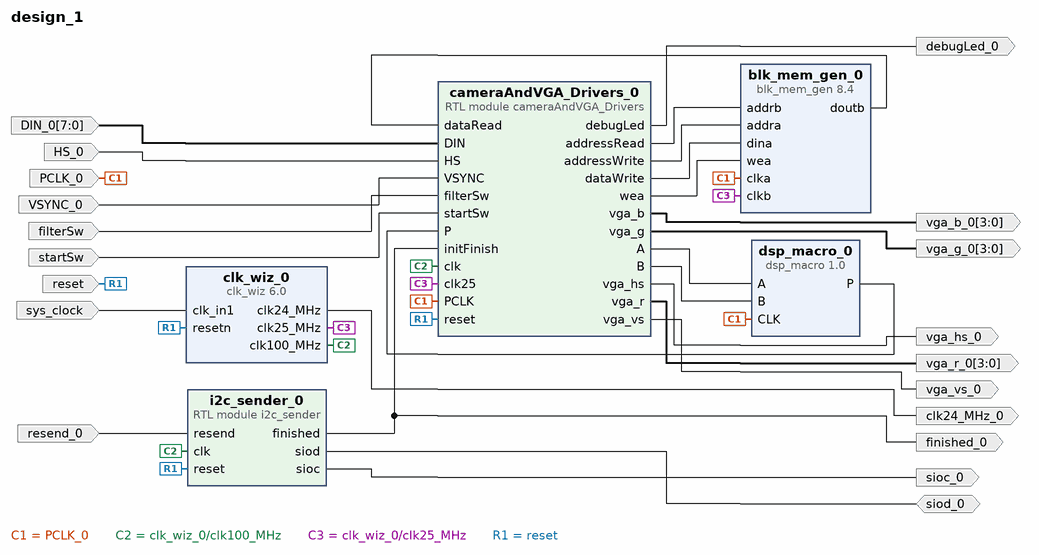
[diagram p0: block diagram of the top level]
# Vivado block design design_1, xc7a100tcsg324-1, Vivado 2021.2
create_bd_design design_1

create_bd_port -dir I -type clk sys_clock
set_property -dict {CONFIG.FREQ_HZ 100000000 CONFIG.PHASE 0.0} [get_bd_ports sys_clock]
create_bd_port -dir I -type rst reset
set_property -dict {CONFIG.POLARITY ACTIVE_LOW} [get_bd_ports reset]
create_bd_port -dir I HS_0
create_bd_port -dir I VSYNC_0
create_bd_port -dir O vga_hs_0
create_bd_port -dir I -from 7 -to 0 DIN_0
create_bd_port -dir I PCLK_0
create_bd_port -dir O vga_vs_0
create_bd_port -dir O -from 3 -to 0 vga_b_0
create_bd_port -dir O -from 3 -to 0 vga_g_0
create_bd_port -dir O -from 3 -to 0 vga_r_0
create_bd_port -dir I resend_0
create_bd_port -dir IO siod_0
create_bd_port -dir O sioc_0
create_bd_port -dir O finished_0
create_bd_port -dir O -type clk clk24_MHz_0
set_property -dict {CONFIG.FREQ_HZ 24000000} [get_bd_ports clk24_MHz_0]
create_bd_port -dir O debugLed_0
create_bd_port -dir I startSw
create_bd_port -dir I filterSw

create_bd_cell -type ip -vlnv xilinx.com:ip:blk_mem_gen:8.4 blk_mem_gen_0
set_property -dict [list \
  CONFIG.Coe_File ../../../../../../../frame1_2.coe \
  CONFIG.Enable_32bit_Address false \
  CONFIG.Enable_A Always_Enabled \
  CONFIG.Enable_B Always_Enabled \
  CONFIG.Fill_Remaining_Memory_Locations true \
  CONFIG.Load_Init_File true \
  CONFIG.Memory_Type Simple_Dual_Port_RAM \
  CONFIG.Operating_Mode_A NO_CHANGE \
  CONFIG.Port_B_Clock 100 \
  CONFIG.Port_B_Enable_Rate 100 \
  CONFIG.Read_Width_B 12 \
  CONFIG.Register_PortB_Output_of_Memory_Primitives false \
  CONFIG.Remaining_Memory_Locations 0 \
  CONFIG.Use_Byte_Write_Enable false \
  CONFIG.Write_Depth_A 307200 \
  CONFIG.Write_Width_A 12 \
  CONFIG.Write_Width_B 12 \
  CONFIG.use_bram_block Stand_Alone \
] [get_bd_cells blk_mem_gen_0]
create_bd_cell -type ip -vlnv xilinx.com:ip:clk_wiz:6.0 clk_wiz_0
set_property -dict [list \
  CONFIG.CLKOUT1_JITTER 151.366 \
  CONFIG.CLKOUT1_PHASE_ERROR 132.063 \
  CONFIG.CLKOUT2_JITTER 200.470 \
  CONFIG.CLKOUT2_PHASE_ERROR 132.063 \
  CONFIG.CLKOUT2_REQUESTED_OUT_FREQ 25 \
  CONFIG.CLKOUT2_USED true \
  CONFIG.CLKOUT3_JITTER 202.114 \
  CONFIG.CLKOUT3_PHASE_ERROR 132.063 \
  CONFIG.CLKOUT3_REQUESTED_OUT_FREQ 24 \
  CONFIG.CLKOUT3_USED true \
  CONFIG.CLK_IN1_BOARD_INTERFACE sys_clock \
  CONFIG.CLK_OUT1_PORT clk100_MHz \
  CONFIG.CLK_OUT2_PORT clk25_MHz \
  CONFIG.CLK_OUT3_PORT clk24_MHz \
  CONFIG.MMCM_CLKFBOUT_MULT_F 6.000 \
  CONFIG.MMCM_CLKIN1_PERIOD 10.0 \
  CONFIG.MMCM_CLKIN2_PERIOD 10.0 \
  CONFIG.MMCM_CLKOUT0_DIVIDE_F 6.000 \
  CONFIG.MMCM_CLKOUT1_DIVIDE 24 \
  CONFIG.MMCM_CLKOUT2_DIVIDE 25 \
  CONFIG.NUM_OUT_CLKS 3 \
  CONFIG.RESET_BOARD_INTERFACE reset \
  CONFIG.RESET_PORT resetn \
  CONFIG.RESET_TYPE ACTIVE_LOW \
  CONFIG.USE_BOARD_FLOW true \
] [get_bd_cells clk_wiz_0]
create_bd_cell -type module -reference i2c_sender i2c_sender_0
create_bd_cell -type ip -vlnv xilinx.com:ip:dsp_macro:1.0 dsp_macro_0
set_property -dict [list \
  CONFIG.areg_3 false \
  CONFIG.areg_4 true \
  CONFIG.breg_3 false \
  CONFIG.breg_4 true \
  CONFIG.creg_3 false \
  CONFIG.creg_4 false \
  CONFIG.creg_5 false \
  CONFIG.instruction1 {A*B} \
  CONFIG.mreg_5 false \
  CONFIG.p_binarywidth 0 \
  CONFIG.p_full_width 36 \
  CONFIG.p_width 36 \
  CONFIG.pipeline_options By_Tier \
  CONFIG.preg_6 true \
  CONFIG.tier_4 true \
  CONFIG.tier_6 true \
] [get_bd_cells dsp_macro_0]
create_bd_cell -type module -reference cameraAndVGA_Drivers cameraAndVGA_Drivers_0

# ---- connections ----

connect_bd_net -net DIN_0_1 [get_bd_ports DIN_0] [get_bd_pins cameraAndVGA_Drivers_0/DIN]
connect_bd_net -net HS_0_1 [get_bd_ports HS_0] [get_bd_pins cameraAndVGA_Drivers_0/HS]
connect_bd_net [get_bd_ports siod_0] [get_bd_pins i2c_sender_0/siod]
connect_bd_net -net PCLK_0_1 [get_bd_ports PCLK_0] \
  [get_bd_pins blk_mem_gen_0/clka] [get_bd_pins dsp_macro_0/CLK] [get_bd_pins cameraAndVGA_Drivers_0/PCLK]
connect_bd_net -net VSYNC_0_1 [get_bd_ports VSYNC_0] [get_bd_pins cameraAndVGA_Drivers_0/VSYNC]
connect_bd_net [get_bd_pins blk_mem_gen_0/doutb] [get_bd_pins cameraAndVGA_Drivers_0/dataRead]
connect_bd_net [get_bd_pins cameraAndVGA_Drivers_0/A] [get_bd_pins dsp_macro_0/A]
connect_bd_net [get_bd_pins cameraAndVGA_Drivers_0/B] [get_bd_pins dsp_macro_0/B]
connect_bd_net [get_bd_pins cameraAndVGA_Drivers_0/addressRead] [get_bd_pins blk_mem_gen_0/addrb]
connect_bd_net [get_bd_pins cameraAndVGA_Drivers_0/addressWrite] [get_bd_pins blk_mem_gen_0/addra]
connect_bd_net [get_bd_pins cameraAndVGA_Drivers_0/dataWrite] [get_bd_pins blk_mem_gen_0/dina]
connect_bd_net [get_bd_pins cameraAndVGA_Drivers_0/debugLed] [get_bd_ports debugLed_0]
connect_bd_net [get_bd_pins cameraAndVGA_Drivers_0/vga_b] [get_bd_ports vga_b_0]
connect_bd_net [get_bd_pins cameraAndVGA_Drivers_0/vga_g] [get_bd_ports vga_g_0]
connect_bd_net [get_bd_pins cameraAndVGA_Drivers_0/vga_hs] [get_bd_ports vga_hs_0]
connect_bd_net [get_bd_pins cameraAndVGA_Drivers_0/vga_r] [get_bd_ports vga_r_0]
connect_bd_net [get_bd_pins cameraAndVGA_Drivers_0/vga_vs] [get_bd_ports vga_vs_0]
connect_bd_net [get_bd_pins cameraAndVGA_Drivers_0/wea] [get_bd_pins blk_mem_gen_0/wea]
connect_bd_net [get_bd_pins clk_wiz_0/clk100_MHz] [get_bd_pins i2c_sender_0/clk] [get_bd_pins cameraAndVGA_Drivers_0/clk]
connect_bd_net [get_bd_pins clk_wiz_0/clk24_MHz] [get_bd_ports clk24_MHz_0]
connect_bd_net [get_bd_pins clk_wiz_0/clk25_MHz] [get_bd_pins blk_mem_gen_0/clkb] [get_bd_pins cameraAndVGA_Drivers_0/clk25]
connect_bd_net [get_bd_pins dsp_macro_0/P] [get_bd_pins cameraAndVGA_Drivers_0/P]
connect_bd_net -net filterSw_0_1 [get_bd_ports filterSw] [get_bd_pins cameraAndVGA_Drivers_0/filterSw]
connect_bd_net [get_bd_pins i2c_sender_0/finished] [get_bd_ports finished_0] [get_bd_pins cameraAndVGA_Drivers_0/initFinish]
connect_bd_net [get_bd_pins i2c_sender_0/sioc] [get_bd_ports sioc_0]
connect_bd_net -net resend_0_1 [get_bd_ports resend_0] [get_bd_pins i2c_sender_0/resend]
connect_bd_net [get_bd_ports reset] [get_bd_pins clk_wiz_0/resetn] [get_bd_pins i2c_sender_0/reset] [get_bd_pins cameraAndVGA_Drivers_0/reset]
connect_bd_net -net startSw_0_1 [get_bd_ports startSw] [get_bd_pins cameraAndVGA_Drivers_0/startSw]
connect_bd_net [get_bd_ports sys_clock] [get_bd_pins clk_wiz_0/clk_in1]

validate_bd_design
save_bd_design
